# EAGLE design Nexus_links_pcb1 (EAGLE 9.2.2)
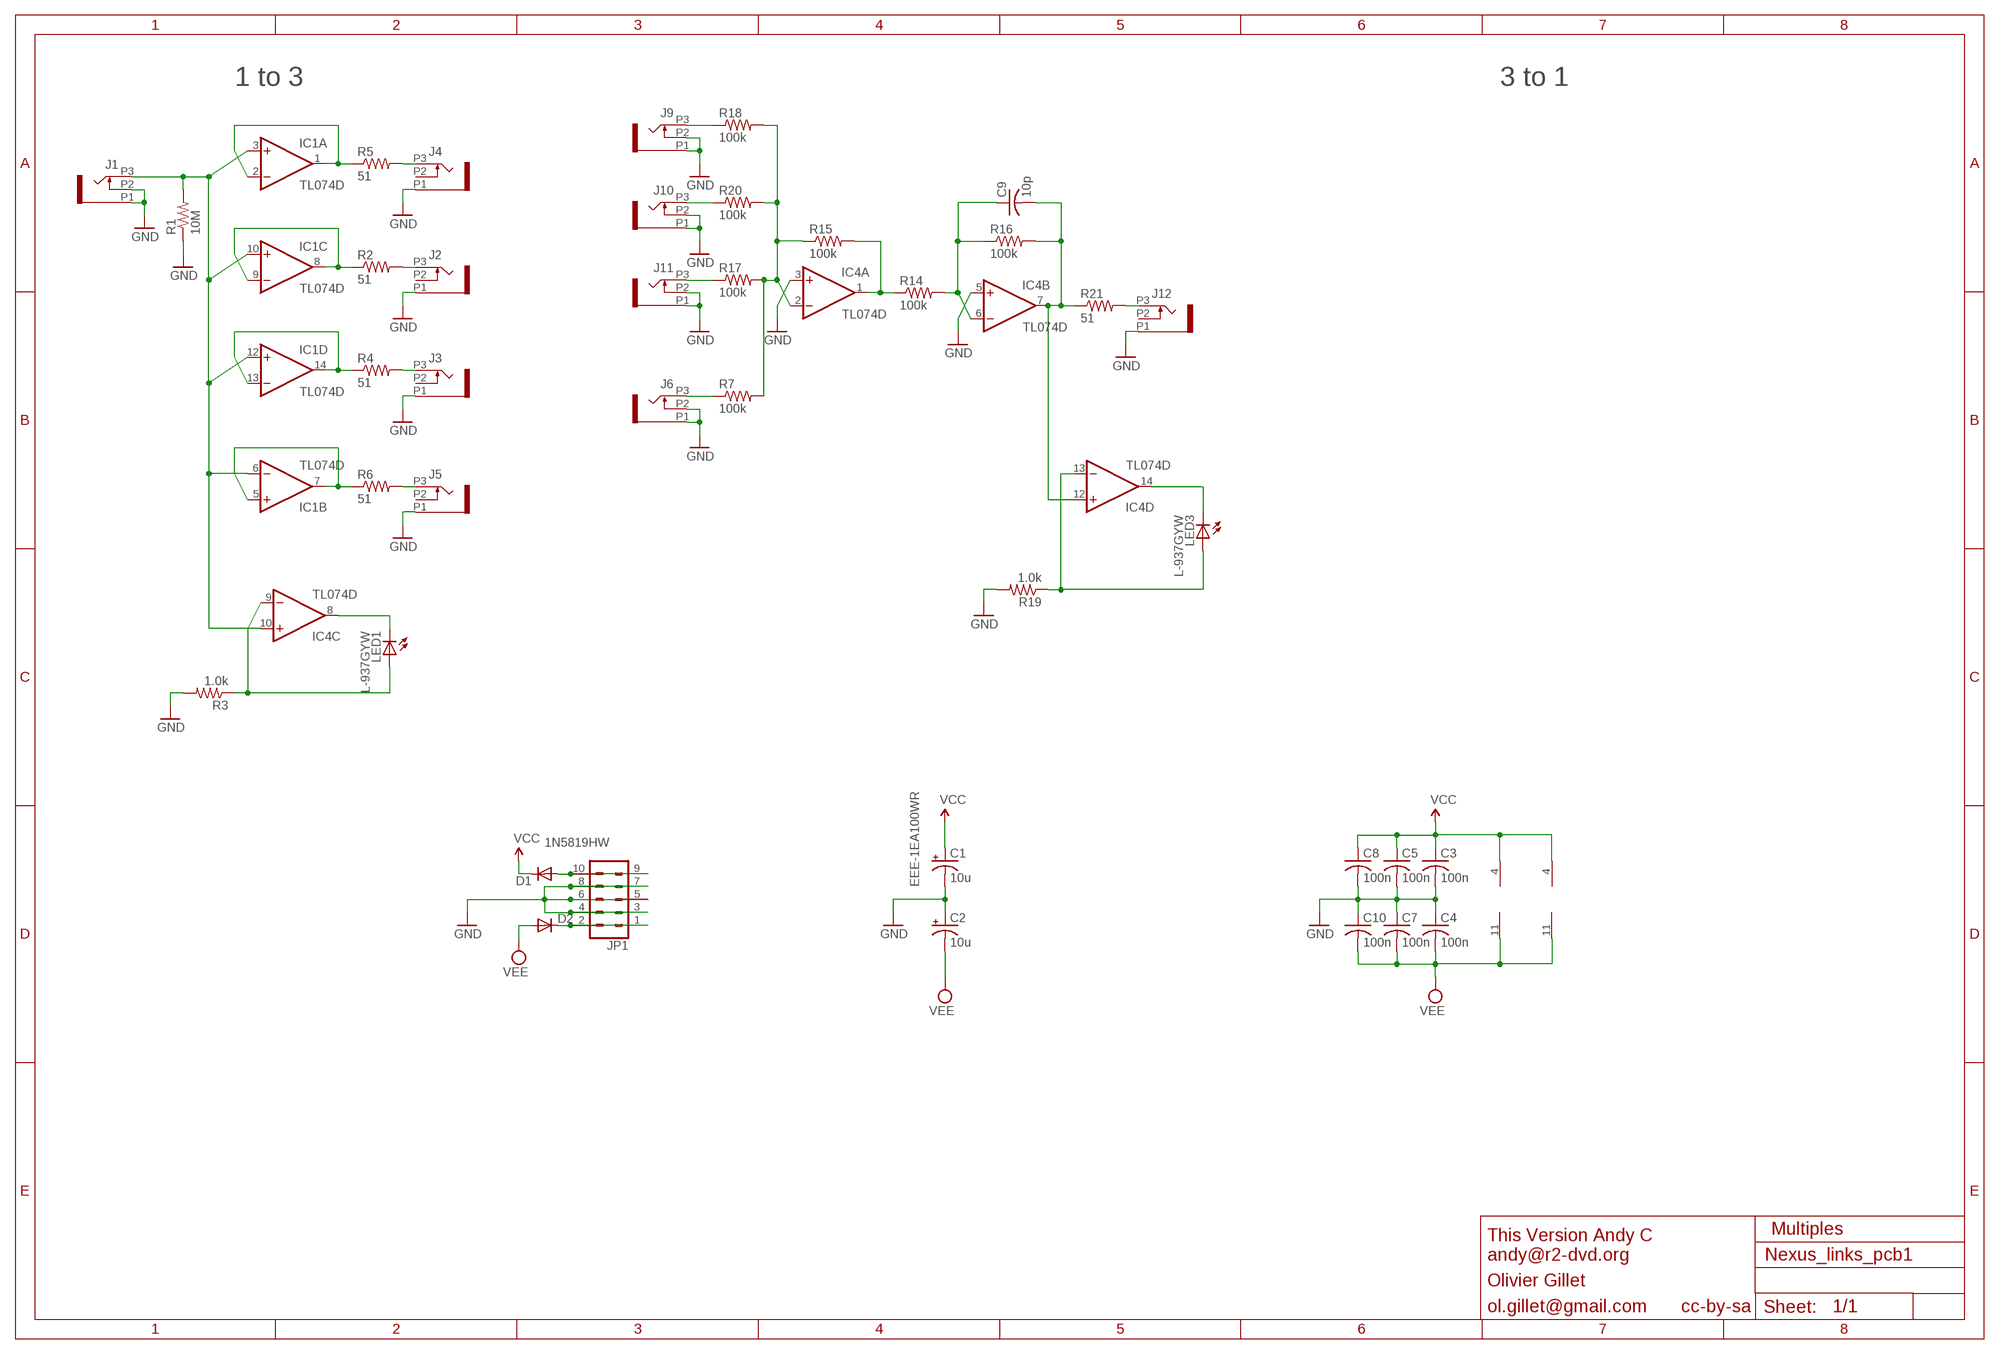
[diagram p0: schematic, sheet 1]

## Parts
C1  10u  CPOL-USA  [PANASONIC_A]
C2  10u  CPOL-USA  [PANASONIC_A]
C3  100n  C-USC0603  [C0603]
C4  100n  C-USC0603  [C0603]
C5  100n  C-USC0603  [C0603]
C7  100n  C-USC0603  [C0603]
C8  100n  C-USC0603  [C0603]
C9  10p  C-USC0603  [C0603]
C10  100n  C-USC0603  [C0603]
D1  1N5819HW  DIODE-SOD123  [SOD123]
D2  1N5819HW  DIODE-SOD123  [SOD123]
IC1  TL074D  [SO14]
IC4  TL074D  [SO14]
J1  PJ301_THONKICONN6  [WQP_PJ_301M6]
J2  PJ301_THONKICONN6  [WQP_PJ_301M6]
J3  PJ301_THONKICONN6  [WQP_PJ_301M6]
J4  PJ301_THONKICONN6  [WQP_PJ_301M6]
J5  PJ301_THONKICONN6  [WQP_PJ_301M6]
J6  PJ301_THONKICONN6  [WQP_PJ_301M6]
J9  PJ301_THONKICONN6  [WQP_PJ_301M6]
J10  PJ301_THONKICONN6  [WQP_PJ_301M6]
J11  PJ301_THONKICONN6  [WQP_PJ_301M6]
J12  PJ301_THONKICONN6  [WQP_PJ_301M6]
JP1  CONN_05X2SHD  [2X5-SHROUDED]
LED1  L-937GYW  LED3MM  [LED3MM]
LED3  L-937GYW  LED3MM  [LED3MM]
R1  10M  R-US_R0603  [R0603]
R2  51  R-US_R0603  [R0603]
R3  1.0k  R-US_R0603  [R0603]
R4  51  R-US_R0603  [R0603]
R5  51  R-US_R0603  [R0603]
R6  51  R-US_R0603  [R0603]
R7  100k  R-US_R0603  [R0603]
R14  100k  R-US_R0603  [R0603]
R15  100k  R-US_R0603  [R0603]
R16  100k  R-US_R0603  [R0603]
R17  100k  R-US_R0603  [R0603]
R18  100k  R-US_R0603  [R0603]
R19  1.0k  R-US_R0603  [R0603]
R20  100k  R-US_R0603  [R0603]
R21  51  R-US_R0603  [R0603]

## Nets
GND: C1.- C2.+ C3.2 C4.1 C5.2 C7.1 C8.2 C10.1 IC4.3(A:+IN) IC4.5(B:+IN) J1.P1 J1.P2 J2.P1 J3.P1 J4.P1 J5.P1 J6.P1 J6.P2 J9.P1 J9.P2 J10.P1 J10.P2 J11.P1 J11.P2 J12.P1 JP1.3 JP1.4 JP1.5 JP1.6 JP1.7 JP1.8 R1.1 R3.2 R19.2
N$1: IC1.5(B:+IN) IC1.7(B:OUT) R6.1
N$2: J11.P3 R17.1
N$3: IC1.1(A:OUT) IC1.2(A:-IN) R5.1
N$4: IC1.8(C:OUT) IC1.9(C:-IN) R2.1
N$5: IC1.13(D:-IN) IC1.14(D:OUT) R4.1
N$6: D2.C JP1.1 JP1.2
N$7: IC1.3(A:+IN) IC1.6(B:-IN) IC1.10(C:+IN) IC1.12(D:+IN) IC4.10(C:+IN) J1.P3 R1.2
N$8: IC4.8(C:OUT) LED1.K(C)
N$9: J10.P3 R20.1
N$10: J6.P3 R7.1
N$11: J4.P3 R5.2
N$12: J2.P3 R2.2
N$13: J3.P3 R4.2
N$14: J5.P3 R6.2
N$18: C9.2 IC4.7(B:OUT) IC4.12(D:+IN) R16.2 R21.1
N$19: IC4.13(D:-IN) LED3.A R19.1
N$20: D1.A JP1.9 JP1.10
N$21: IC4.9(C:-IN) LED1.A R3.1
N$22: J9.P3 R18.1
N$23: J12.P3 R21.2
N$24: IC4.2(A:-IN) R7.2 R15.1 R17.2 R18.2 R20.2
N$25: IC4.1(A:OUT) R14.1 R15.2
N$27: C9.1 IC4.6(B:-IN) R14.2 R16.1
N$30: IC4.14(D:OUT) LED3.K(C)
VCC: C1.+ C3.1 C5.1 C8.1 D1.C IC1.4(P:V+) IC4.4(P:V+)
VEE: C2.- C4.2 C7.2 C10.2 D2.A IC1.11(P:V-) IC4.11(P:V-)
Unconnected: J2.P2 J3.P2 J4.P2 J5.P2 J12.P2

## Notes on the sheet
- 1 to 3 | 3 to 1
- EEE-1EA100WR
- Multiples
- This Version Andy C
  andy@r2-dvd.org
- Olivier Gillet
- ol.gillet@gmail.com | cc-by-sa

## Library data of the parts
C1 C2 = rcl:CPOL-US: POLARIZED CAPACITOR, American symbol; RSPARTNUMBER: 568-711
C3 = rcl:C-US: CAPACITOR, American symbol; RSPARTNUMBER: 264-4416
C4 C5 C7 C8 C10 = rcl:C-US: CAPACITOR, American symbol
C9 = rcl:C-US: CAPACITOR, American symbol; RSPARTNUMBER: 601-0198
D1 D2 = diode:DIODE-: DIODE; RSPARTNUMBER: 708-2197
IC1 = GMSN-R2Project:TL074: OP AMP; RSPARTNUMBER: 661-0076
IC4 = GMSN-R2Project:TL074: OP AMP
J1-J6 J9-J12 = og-pj301:PJ301_THONKICONN
JP1 = SparkFun-Connectors:CONN_05X2: Multi connection point. Often used as Generic Header-pin footprint for 0.1 inch spaced/style header connections For AVR SPI programming port, see special device with nice symbol: "AVR_SPI_PROG_5x2.dev" You can populate with any combo of single row headers, but if you'd like an exact match, check these: 2x5 AVR ICSP Male Header <https://www.sparkfun.com/products/778> (PRT-00778) 2x5 Pin Shrouded Header <https://www.sparkfun.com/products/8506> (PRT-08506) On any of the 0.1 inch spaced packages, you can populate with these: Break Away Headers - Straight <https://www.sparkfun.com/products/116> (PRT-00116) Break Away Male Headers - Right Angle <https://www.sparkfun.com/products/553> (PRT-00553) Female Headers <https://www.sparkfun.com/products/115> (PRT-00115) Break Away Headers - Machine Pin <https://www.sparkfun.com/products/117> (PRT-00117) Break Away Female Headers - Swiss Machine Pin <https://www.sparkfun.com/products/743> (PRT-00743) Special note: the shrouded connector mates well with our 5x2 ribbon cables: 2x5 Pin IDC Ribbon Cable <https://www.sparkfun.com/products/8535> (PRT-08535); PROD_ID: CONN-08671; SF_ID: PRT-08506
LED1 LED3 = led:LED: LED OSRAM: - CHIPLED LG R971, LG N971, LY N971, LG Q971, LY Q971, LO R971, LY R971 LH N974, LH R974 LS Q976, LO Q976, LY Q976 LO Q996 - Hyper CHIPLED LW Q18S LB Q993, LB Q99A, LB R99A - SideLED LS A670, LO A670, LY A670, LG A670, LP A670 LB A673, LV A673, LT A673, LW A673 LH A674 LY A675 LS A676, LA A676, LO A676, LY A676, LW A676 LS A679, LY A679, LG A679 - Hyper Micro SIDELED® LS Y876, LA Y876, LO Y876, LY Y876 LT Y87S - SmartLED LW L88C, LW L88S LB L89C, LB L89S, LG L890 LS L89K, LO L89K, LY L89K LS L896, LA L896, LO L896, LY L896 - TOPLED LS T670, LO T670, LY T670, LG T670, LP T670 LSG T670, LSP T670, LSY T670, LOP T670, LYG T670 LG T671, LOG T671, LSG T671 LB T673, LV T673, LT T673, LW T673 LH T674 LS T676, LA T676, LO T676, LY T676, LB T676, LH T676, LSB T676, LW T676 LB T67C, LV T67C, LT T67C, LS T67K, LO T67K, LY T67K, LW E67C LS E67B, LA E67B, LO E67B, LY E67B, LB E67C, LV E67C, LT E67C LW T67C LS T679, LY T679, LG T679 LS T770, LO T770, LY T770, LG T770, LP T770 LB T773, LV T773, LT T773, LW T773 LH T774 LS E675, LA E675, LY E675, LS T675 LS T776, LA T776, LO T776, LY T776, LB T776 LHGB T686 LT T68C, LB T68C - Hyper Mini TOPLED® LB M676 - Mini TOPLED Santana® LG M470 LS M47K, LO M47K, LY M47K Source: http://www.osram.convergy.de LUXEON: - LUMILED® LXK2-PW12-R00, LXK2-PW12-S00, LXK2-PW14-U00, LXK2-PW14-V00 LXK2-PM12-R00, LXK2-PM12-S00, LXK2-PM14-U00 LXK2-PE12-Q00, LXK2-PE12-R00, LXK2-PE12-S00, LXK2-PE14-T00, LXK2-PE14-U00 LXK2-PB12-K00, LXK2-PB12-L00, LXK2-PB12-M00, LXK2-PB14-N00, LXK2-PB14-P00, LXK2-PB14-Q00 LXK2-PR12-L00, LXK2-PR12-M00, LXK2-PR14-Q00, LXK2-PR14-R00 LXK2-PD12-Q00, LXK2-PD12-R00, LXK2-PD12-S00 LXK2-PH12-R00, LXK2-PH12-S00 LXK2-PL12-P00, LXK2-PL12-Q00, LXK2-PL12-R00 Source: www.luxeon.com KINGBRIGHT: KA-3528ASYC Source: www.kingbright.com; RSPARTNUMBER: 228-5663
R1-R7 R14-R21 = rcl:R-US_: RESISTOR, American symbol

## Board
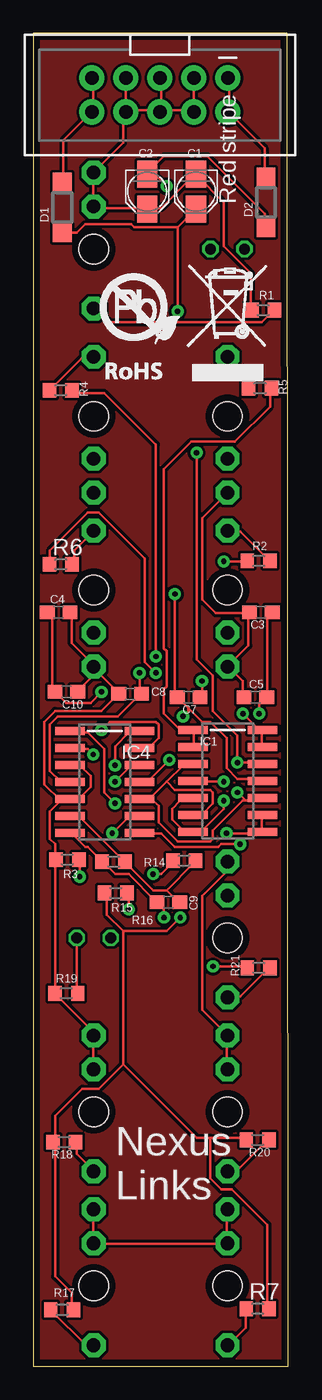
[diagram p1: board, top side]
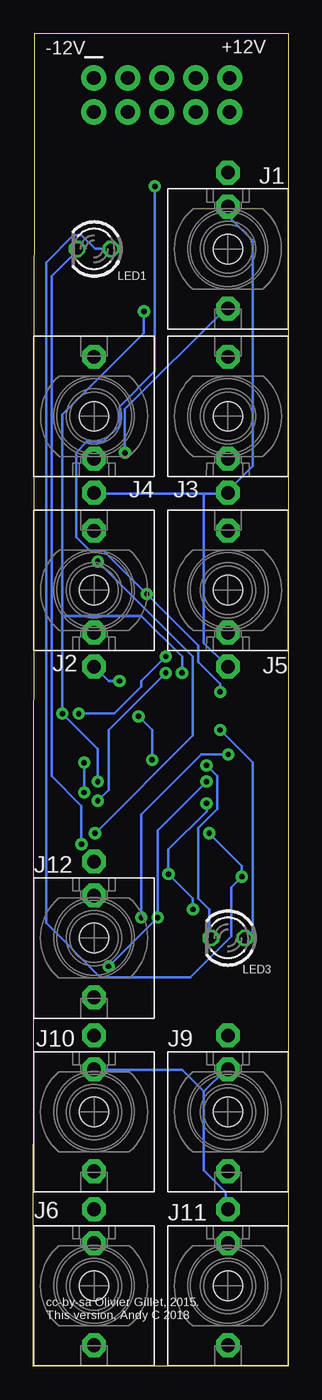
[diagram p2: board, bottom side, seen from below]

Size 19.03 x 99.62 mm. Coordinates in mm from the lower left corner, seen from the top.
Outline: 0,0 19.03,0 18.95,99.62 0,99.62 0,0
Copper layers (1*16): Top 0.035mm / dielectric 1.5mm / Bottom 0.035mm
Design rules "PCBCart-Standard *": minimum track width 8mil, minimum drill 0.4mm, track to track 8mil, track to pad 8mil, pad to pad 8mil, via to via 8mil, smd to smd 8mil, copper to edge 20mil, drill to drill 8mil, minimum pad ring 8mil, minimum via ring 10mil, stop-mask expansion 3mil, vias tented up to drill 25mil, thermal gap 8mil

### Footprints (pad centres in the part's own frame; a part is rotated, then mirrored left to right if it is on the bottom)
PANASONIC_A = smd 2 x 1.5: + 1.3,0; - -1.3,0
C0603 = smd 1.1 x 1: 1 -0.85,0; 2 0.85,0
SOD123 = smd 1.4 x 1.4: A 1.9,0; C -1.9,0
SO14 = smd 0.6 x 2.2: 1 -3.81,-2.6; 2 -2.54,-2.6; 3 -1.27,-2.6; 4 0,-2.6; 5 1.27,-2.6; 6 2.54,-2.6; 7 3.81,-2.6; 8 3.81,2.6; 9 2.54,2.6; 10 1.27,2.6; 11 0,2.6; 12 -1.27,2.6; 13 -2.54,2.6; 14 -3.81,2.6
WQP_PJ_301M6 = drill 1.016 pad 1.778 octagon: P1 0,-5.715; P2 0,-3.175; P3 0,4.445 | hole 2.2: 0,0
2X5-SHROUDED = drill 1.016 pad 1.88: 1 -1.27,5.08; 2 1.27,5.08; 3 -1.27,2.54; 4 1.27,2.54; 5 -1.27,0; 6 1.27,0; 7 -1.27,-2.54; 8 1.27,-2.54; 9 -1.27,-5.08; 10 1.27,-5.08
LED3MM = drill 0.813 octagon: A -1.27,0; K 1.27,0
R0603 = smd 1 x 1.1: 1 -0.85,0; 2 0.85,0

### Placement (x,y rotation side)
C1  12.14,87.79 270 top
C2  8.49,87.79 270 top
C3  16.99,56.36 180 top
C4  1.88,56.36 180 top
C5  16.59,50.01 180 top
C7  11.59,50.01 180 top
C8  7.22,50.24 180 top
C9  10.08,34.69 180 top
C10  2.46,50.4 180 top
D1  2.14,86.6 90 top
D2  17.38,87 270 top
IC1  14.53,43.74 270 top
IC4  5.32,43.66 270 top
J1  4.5,83.5 180 bottom
J2  14.5,58 0 bottom
J3  4.5,71 0 bottom
J4  14.5,71 0 bottom
J5  4.5,58 0 bottom
J6  14.5,6 180 bottom
J9  4.5,19 180 bottom
J10  14.5,19 180 bottom
J11  4.5,6 180 bottom
J12  14.5,32 180 bottom
JP1  9.45,95.01 270 top
LED1  14.5,83.5 180 bottom
LED3  4.5,32 180 bottom
R1  17.17,78.93 0 top
R2  16.83,60.19 0 top
R3  2.54,37.86 180 top
R4  2.04,72.95 180 top
R5  16.93,73.1 180 top
R6  2.04,59.93 0 top
R7  16.75,4.29 0 top
R14  11.27,37.78 0 top
R15  6.14,35.36 0 top
R16  5.99,37.7 180 top
R17  2.14,4.21 0 top
R18  2.3,16.75 180 top
R19  2.46,27.86 180 top
R20  16.75,16.91 180 top
R21  16.83,29.77 0 top
U$2  [ROHS]  4.09,73.07 0 top

### Tracks (layer width: path | path; a pad name or v marks a point on that pad's centre or on a via)
GND  (via drill 0.4)
  Top 0.203: JP1.3 11.99,96.11 11.99,93.88 JP1.4 11.79,93.88 9.55,93.88 | 6.91,93.88 6.91,96.11 JP1.7 | 9.55,93.88 9.55,96.11 JP1.5 | 6.91,93.88 9.35,93.88 JP1.6 9.55,93.88 | 6.91,93.88 JP1.8 6.71,93.67 6.71,91.44 4.67,89.41 J1.P1 4.47,89.2 4.47,86.77 J1.P2 4.67,86.56 8.33,86.56 C2.+ 8.53,86.56 9.55,86.56 11.99,89 C1.- 12.19,89 14.22,86.97 14.22,83.72 16.26,81.69 16.26,79.05 R1.1 | v12.6,51.21 12.6,50.19 C7.1 | C5.2 15.65,50.19 15.65,51.21 14.63,52.22 J2.P1 14.63,52.43 16.05,53.85 16.05,56.29 | 16.05,56.29 13.61,56.29 12.6,57.3 12.6,63.4 14.43,65.23 J4.P1 | 16.05,56.29 C3.2 | J10.P2 14.43,22.35 14.43,24.59 J10.P1 14.43,24.79 12.6,26.62 12.6,35.15 14.43,36.98 14.43,37.59 J12.P1 | J11.P1 4.47,11.58 4.47,9.35 J11.P2 4.67,9.14 14.43,9.14 J6.P2 14.43,9.35 14.43,11.58 J6.P1 | C4.1 2.85,56.29 2.85,54.05 4.47,52.43 J5.P1 | 4.67,52.02 4.47,52.22 J5.P1 | 4.67,52.02 6.3,50.39 C8.2 6.3,50.19 5.08,48.97 1.63,48.97 0.81,48.16 0.81,43.48 2.03,42.27 | 4.67,52.02 4.67,51.82 3.45,50.6 C10.1 | 4.67,52.02 J5.P1 | 2.03,42.27 1.22,41.45 1.22,39.42 1.63,39.01 1.63,38 R3.2 1.63,37.8 1.63,28.04 R19.2 1.63,27.84 4.67,24.79 J9.P1 4.47,24.59 4.47,22.35 J9.P2 | 2.03,42.27 2.64,42.27 IC4.5 | IC4.3 2.85,44.91 3.45,44.91 4.27,44.09 4.27,43.28 3.45,42.47 2.85,42.47 IC4.5 | 2.03,42.27 IC4.5
  Bottom 0.203: v12.6,51.21 13.41,51.21 14.43,52.22 J2.P1 | 6.3,65.23 14.43,65.23 J4.P1 | 6.3,65.23 4.67,65.23 J3.P1 4.47,65.43 2.64,67.26 2.64,84.12 4.47,85.95 4.47,86.56 J1.P2 | 6.3,20.52 6.3,14.63 4.67,13.01 4.67,11.79 J11.P1 | 6.3,20.52 4.67,22.15 J9.P2 | 6.3,20.52 7.92,22.15 14.43,22.15 J10.P2 | 6.3,65.23 6.3,54.05 4.67,52.43 J5.P1
N$1  (via drill 0.4)
  Top 0.203: v9.14,51.82 8.33,52.63 8.33,60.35 4.88,63.8 4.06,63.8 1.22,60.96 1.22,59.94 R6.1 | v14.22,42.27 14.22,41.66 12.6,40.03 11.99,40.03 IC1.7 11.79,40.03 11.18,40.03 10.36,40.84 10.36,41.66 10.97,42.27 11.79,42.27 IC1.5
  Bottom 0.203: v9.14,51.82 13.41,47.55 13.41,43.08 v14.22,42.27
N$2
  Top 0.203: R17.1 1.42,4.06 3.86,1.63 4.47,1.63 J11.P3
N$3
  Top 0.203: R5.1 17.68,72.95 17.68,71.73 15.04,69.09 11.79,69.09 9.75,67.06 9.75,53.65 9.96,53.44 9.96,50.8 9.75,50.6 9.75,48.77 10.97,47.55 11.79,47.55 IC1.1 11.99,47.35 11.99,46.33 IC1.2
N$4  (via drill 0.4)
  Top 0.203: v14.22,60.15 15.85,60.15 R2.1 | v14.43,39.83 17.07,39.83 IC1.8 17.07,40.03 17.07,41.05 IC1.9
  Bottom 0.203: v14.22,60.15 7.11,53.03 7.11,47.14 v14.43,39.83
N$5  (via drill 0.4)
  Top 0.203: v9.14,53.03 9.14,68.89 5.28,72.75 3.05,72.75 R4.1 | 17.07,47.35 v15.65,48.77 | 17.07,47.35 17.07,46.33 IC1.13 | 17.07,47.35 IC1.14
  Bottom 0.203: v9.14,53.03 10.97,51.21 10.97,50.8 13.01,48.77 v15.65,48.77
N$6
  Top 0.203: D2.C 17.27,89 17.27,91.03 14.63,93.67 JP1.2 14.63,93.88 14.63,96.11 JP1.1
N$7  (via drill 0.4)
  Top 0.203: 8.74,42.47 7.92,42.47 IC4.10 8.74,42.47 | 9.96,43.69 11.18,44.91 11.79,44.91 IC1.3 | 9.96,43.69 8.74,42.47 | 9.96,43.69 10.57,43.08 13.21,43.08 13.41,42.88 13.41,42.06 12.6,41.25 11.99,41.25 IC1.6 | 15.85,42.27 15.65,42.27 13.41,40.03 13.41,39.42 13.21,39.22 10.77,39.22 9.35,40.64 9.35,41.86 8.74,42.47 | 15.85,42.27 17.07,42.27 IC1.10 | 15.85,42.27 v15.24,42.88 | IC1.12 17.07,45.11 v15.24,45.11 15.24,47.14 13.41,48.97 13.41,51.61 12.19,52.83 v12.19,68.28 | R1.2 17.88,78.84 17.07,78.03 5.69,78.03 4.67,79.05 J1.P3
  Bottom 0.203: v15.24,42.88 v15.24,45.11 | v12.19,68.28 12.19,71.53 4.67,79.05 J1.P3
N$8  (via drill 0.4)
  Top 0.203: v15.44,39.01 14.02,39.01 13.82,38.81 10.57,38.81 9.55,39.83 7.92,39.83 IC4.8
  Bottom 0.203: v15.44,39.01 15.44,41.86 17.68,44.09 17.68,81.48 15.85,83.31 LED1.K
N$9
  Top 0.203: R20.1 17.48,16.87 15.24,14.63 14.63,14.63 J10.P3
N$10
  Top 0.203: R7.1 15.85,4.27 15.85,2.85 14.63,1.63 J6.P3
N$11
  Top 0.203: R5.2 16.05,73.15 16.05,73.97 14.63,75.39 J4.P3
N$12
  Top 0.203: R2.2 17.48,60.35 15.44,62.38 14.63,62.38 J2.P3
N$13
  Top 0.203: R4.2 1.22,72.95 3.66,75.39 4.47,75.39 J3.P3
N$14
  Top 0.203: R6.2 3.05,59.94 3.05,60.96 4.47,62.38 J5.P3
N$15
  pour Top: 0,0 19,0 19,99.5 0,99.5
N$18  (via drill 0.4)
  Top 0.203: v13.41,29.87 15.85,29.87 R21.1 | v9.75,33.53 9.75,34.14 9.35,34.54 C9.2 9.14,34.75 7.11,36.78 6.1,36.78 5.28,37.59 R16.2 5.08,37.8 4.06,38.81 3.86,38.81 2.85,39.83 IC4.7 | v6.1,43.69 7.32,44.91 7.72,44.91 IC4.12
  Bottom 0.203: v13.41,29.87 v9.75,33.53 9.75,40.03 v6.1,43.69
N$19  (via drill 0.4)
  Top 0.203: R19.1 3.25,28.04 3.25,31.9 LED3.A | v5.08,47.55 5.69,48.16 9.14,48.16 9.35,47.95 9.35,46.94 8.74,46.33 7.92,46.33 IC4.13
  Bottom 0.203: v5.08,47.55 2.64,45.11 2.64,32.51 3.05,32.11 LED3.A
N$20
  Top 0.203: D1.A 2.23,88.59 2.23,91.64 4.27,93.67 JP1.10 4.47,93.88 4.47,96.11 JP1.9
N$21  (via drill 0.4)
  Top 0.203: v3.45,36.58 3.45,37.8 R3.1 | v5.89,39.83 7.11,41.05 7.72,41.05 IC4.9
  Bottom 0.203: v5.89,39.83 3.45,37.39 v3.45,36.58 4.27,35.76 4.27,32.11 7.32,29.06 14.02,29.06 18.09,33.12 18.09,82.5 16.05,84.53 15.44,84.53 14.43,83.52 13.41,83.52 LED1.A
N$22
  Top 0.203: R18.1 3.25,16.66 3.25,15.85 4.47,14.63 J9.P3
N$23
  Top 0.203: R21.2 17.48,29.67 15.44,27.64 14.63,27.64 J12.P3
N$24  (via drill 0.4)
  Top 0.203: R17.2 2.85,4.27 2.85,5.49 1.63,6.71 1.63,16.66 R18.2 1.63,16.87 1.63,18.69 3.66,20.73 4.88,20.73 6.71,22.55 | 6.71,32.51 5.49,33.73 5.49,35.36 R15.1 | 6.71,22.55 6.71,32.51 | 13.21,17.07 12.19,17.07 6.71,22.55 | 13.21,17.07 15.85,17.07 R20.2 | 13.21,17.07 13.21,14.02 14.02,13.21 14.83,13.21 17.48,10.57 17.48,4.47 R7.2 | v4.47,45.72 4.06,46.13 2.85,46.13 IC4.2 | v10.97,33.53 9.96,32.51 6.71,32.51
  Bottom 0.203: v4.47,45.72 6.5,45.72 10.97,41.25 v10.97,33.53
N$25  (via drill 0.4)
  Top 0.203: v7.11,34.14 7.11,35.36 R15.2 | v8.94,36.78 9.55,36.78 10.36,37.59 R14.1 | v6.1,42.06 5.28,42.88 5.28,46.13 4.06,47.35 2.85,47.35 IC4.1
  Bottom 0.203: v7.11,34.14 7.11,34.95 v8.94,36.78 8.94,38.61 6.1,41.45 v6.1,42.06
N$27
  Top 0.203: 9.96,35.56 8.94,35.56 6.91,37.59 R16.1 6.71,37.8 3.45,41.05 2.85,41.05 IC4.6 | 9.96,35.56 10.77,34.75 C9.1 | 9.96,35.56 11.99,37.59 R14.2
N$30  (via drill 0.4)
  Top 0.203: v6.1,44.91 6.1,46.33 7.11,47.35 7.72,47.35 IC4.14
  Bottom 0.203: v6.1,44.91 5.28,44.09 5.28,41.66 6.71,40.23 6.71,34.95 5.89,34.14 5.89,32.11 LED3.K
VCC  (via drill 0.4)
  Top 0.203: IC4.4 2.64,43.69 2.03,43.69 1.22,44.5 1.22,47.95 1.83,48.56 6.3,48.56 7.92,50.19 C8.1 7.92,50.39 v7.92,51.82 | 10.77,85.14 7.52,85.14 7.32,85.34 3.86,85.34 3.25,84.73 2.23,84.73 D1.C | 10.77,85.14 11.99,86.36 C1.+ | C3.1 17.68,56.29 17.48,56.08 17.48,50.19 C5.1 17.27,49.99 16.87,49.58 v16.87,48.77 | v14.22,43.69 11.99,43.69 IC1.4 | v10.77,78.84 10.77,85.14
  Bottom 0.203: v14.22,43.69 14.22,46.13 v16.87,48.77 16.87,56.08 | v10.77,78.84 10.77,77.22 16.87,71.12 16.87,56.08 | v7.92,51.82 7.92,53.03 10.97,56.08 16.87,56.08
VEE  (via drill 0.4)
  Top 0.203: 8.74,89.41 8.53,89.2 C2.- 8.74,89.41 | 8.74,89.41 9.75,90.42 13.01,90.42 17.27,86.16 17.27,85.14 D2.A | C4.2 1.22,56.29 1.42,56.08 1.42,50.6 C10.2 1.63,50.39 2.44,49.58 4.27,49.58 v5.08,50.39 | 11.58,49.17 12.6,48.16 13.21,48.16 14.43,46.94 14.43,44.7 15.24,43.89 17.07,43.89 IC1.11 | 11.58,49.17 10.77,49.99 C7.2 10.57,50.19 v10.57,57.71 | v10.16,45.31 8.53,43.69 7.92,43.69 IC4.11 | v11.18,48.56 11.58,48.97 11.58,49.17 | v9.96,88.19 8.74,89.41
  Bottom 0.203: v10.16,45.31 10.16,47.55 v11.18,48.56 | v5.08,50.39 5.08,51 6.71,52.63 6.71,53.85 v10.57,57.71 13.82,60.96 14.83,60.96 15.85,61.98 15.85,68.28 15.04,69.09 13.82,69.09 12.6,70.31 12.6,71.73 9.96,74.37 v9.96,88.19

### Text on the board
tPlace: Red stripe
tNames: Nexus / Links
bNames: +12V | -12V | cc-by-sa Olivier Gillet, 2015. / This version, Andy C 2018